# EAGLE design mSD-Breakout_v10 (EAGLE 7.5.0)
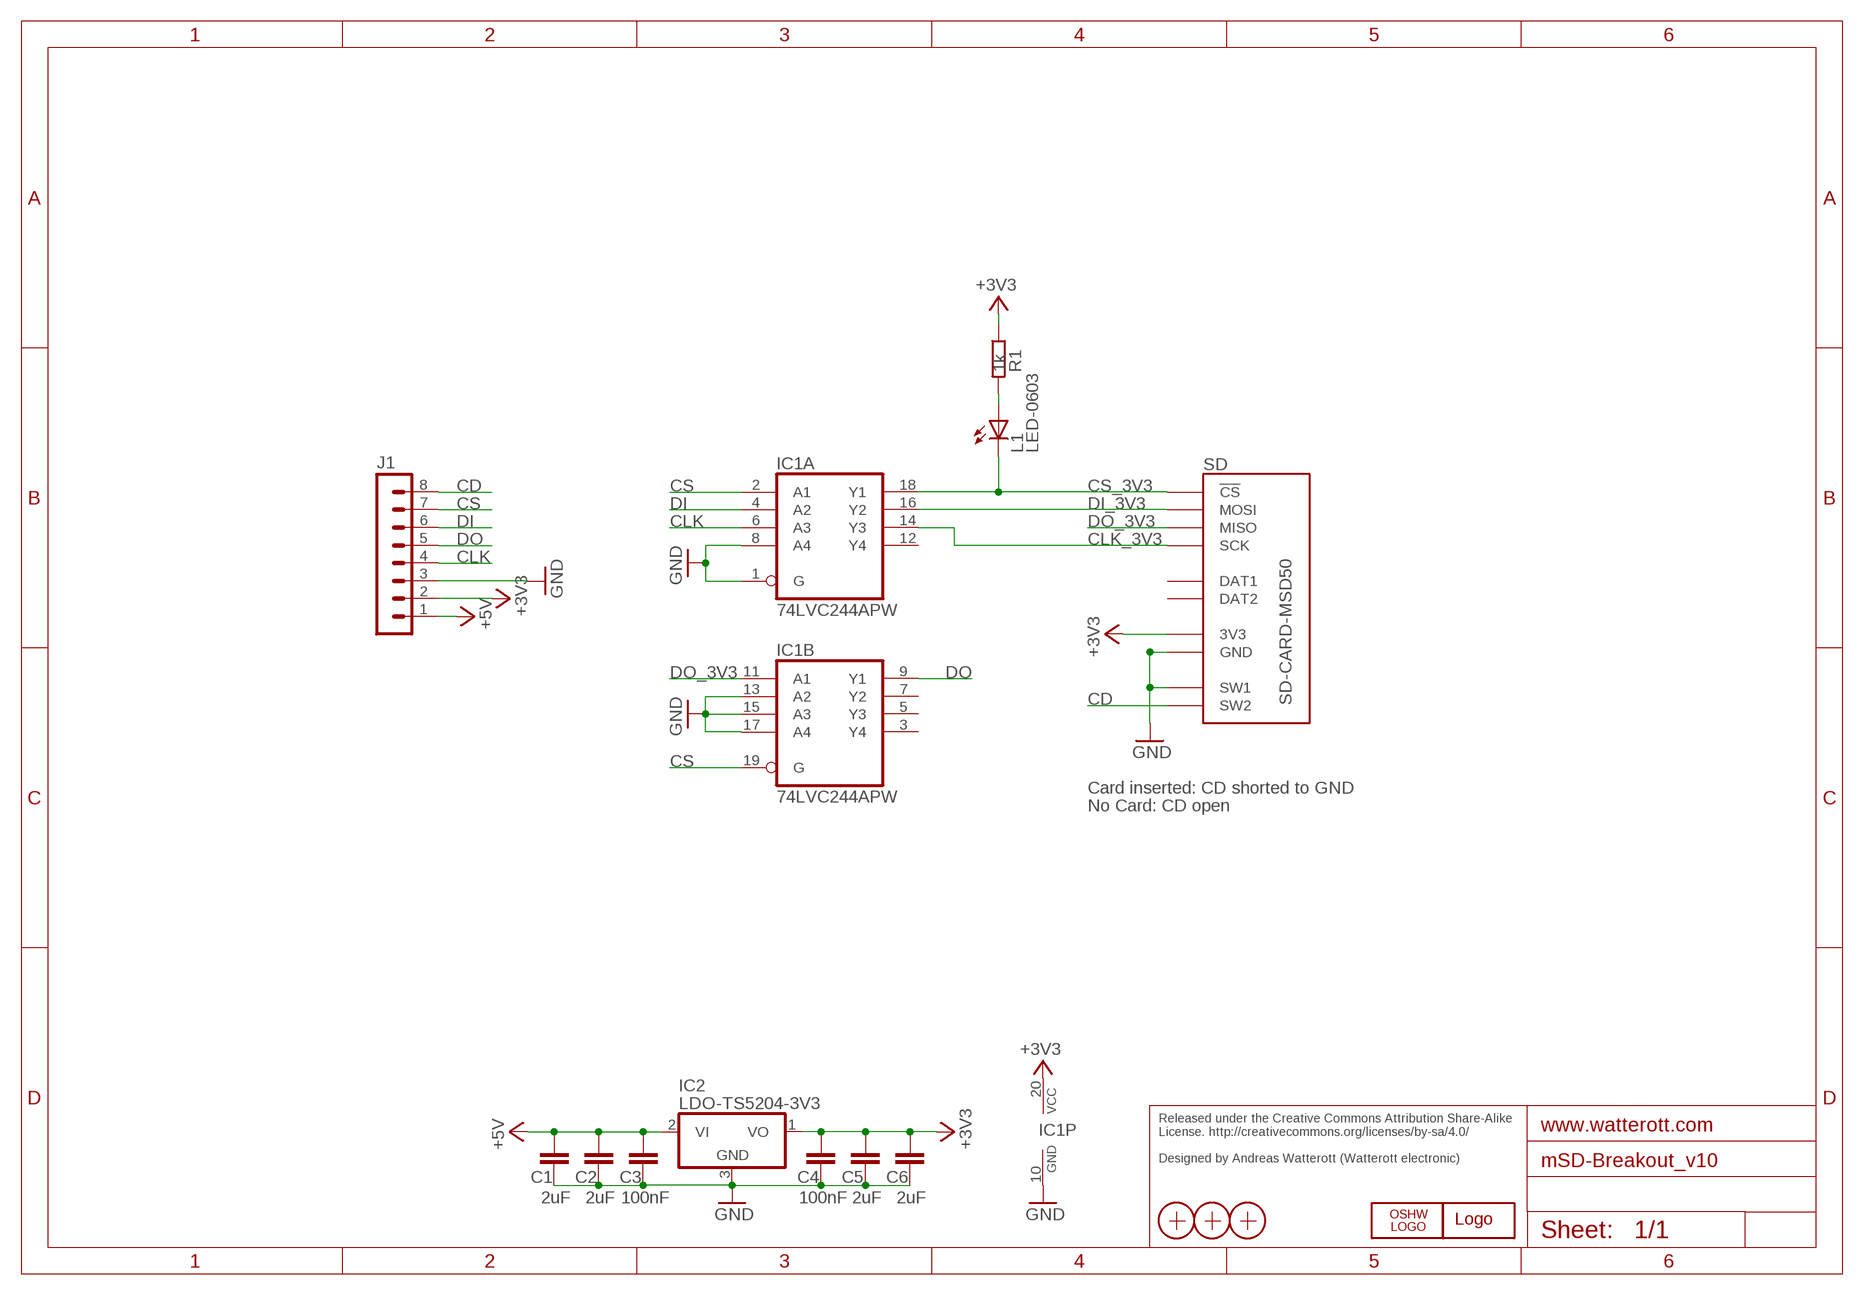
[diagram p0: schematic, sheet 1]

## Parts
C1  2uF  C-EUC0603  [C0603]
C2  2uF  C-EUC0603  [C0603]
C3  100nF  C-EUC0603  [C0603]
C4  100nF  C-EUC0603  [C0603]
C5  2uF  C-EUC0603  [C0603]
C6  2uF  C-EUC0603  [C0603]
IC1  74LVC244APW  74LVC244PW  [TSSOP20]
IC2  LDO-TS5204-3V3  LDO-TS5204  [SOT23]
J1  MA08-1  [MA08-1]
L1  LED-0603  [LED_0603]
LOGO1  OSHW_LOGOX0100  [OSHW_6X100]
LOGO2  LOGO-SPARK_PLACE  [SPARK_TPLACE]
R1  1k  R-EU_R0603  [R0603]
SD  SD-CARD-MSD50  [SD_5031821853]
X1  PASSER  [PASSER]
X2  PASSER  [PASSER]
X3  PASSER  [PASSER]

## Nets
+3V3: C4.1 C5.1 C6.1 IC1.20(P:VCC) IC2.1(VO) J1.2 R1.1 SD.VCC(3V3)
+5V: C1.1 C2.1 C3.1 IC2.2(VI) J1.1
CD: J1.8 SD.SW2
CLK: IC1.6(A:A3) J1.4
CLK_3V3: IC1.14(A:Y3) SD.SCK
CS: IC1.2(A:A1) IC1.19(B:G) J1.7
CS_3V3: IC1.18(A:Y1) L1.C SD.CS(!CS)
DI: IC1.4(A:A2) J1.6
DI_3V3: IC1.16(A:Y2) SD.MOSI
DO: IC1.9(B:Y1) J1.5
DO_3V3: IC1.11(B:A1) SD.MISO
GND: C1.2 C2.2 C3.2 C4.2 C5.2 C6.2 IC1.1(A:G) IC1.8(A:A4) IC1.10(P:GND) IC1.13(B:A2) IC1.15(B:A3) IC1.17(B:A4) IC2.3(GND) J1.3 SD.GND SD.SW1
N$1: L1.A R1.2
Unconnected: IC1.3(B:Y4) IC1.5(B:Y3) IC1.7(B:Y2) IC1.12(A:Y4) SD.DAT1 SD.DAT2

## Notes on the sheet
- Card inserted: CD shorted to GND
- No Card: CD open
- Released under the Creative Commons Attribution Share-Alike 
  License. http://creativecommons.org/licenses/by-sa/4.0/
  
  Designed by Andreas Watterott (Watterott electronic)

## Library data of the parts
C1-C6 = rcl:C-EU: CAPACITOR, European symbol
IC1 = we-chip:74*244: 74x244 Octal Buffer and Line Driver (3-State)
IC2 = we-power:LDO
J1 = we-con:MA08-1: PIN HEADER; OC_FARNELL: unknown; OC_NEWARK: unknown
L1 = we-opto:LED
LOGO1 = we-symbol:OSHW_LOGO
LOGO2 = we-symbol:LOGO
R1 = rcl:R-EU_: RESISTOR, European symbol
SD = we-con:SD-CARD; DIGIKEY: WM9750TR-ND
X1-X3 = we-symbol:PASSER

## Board
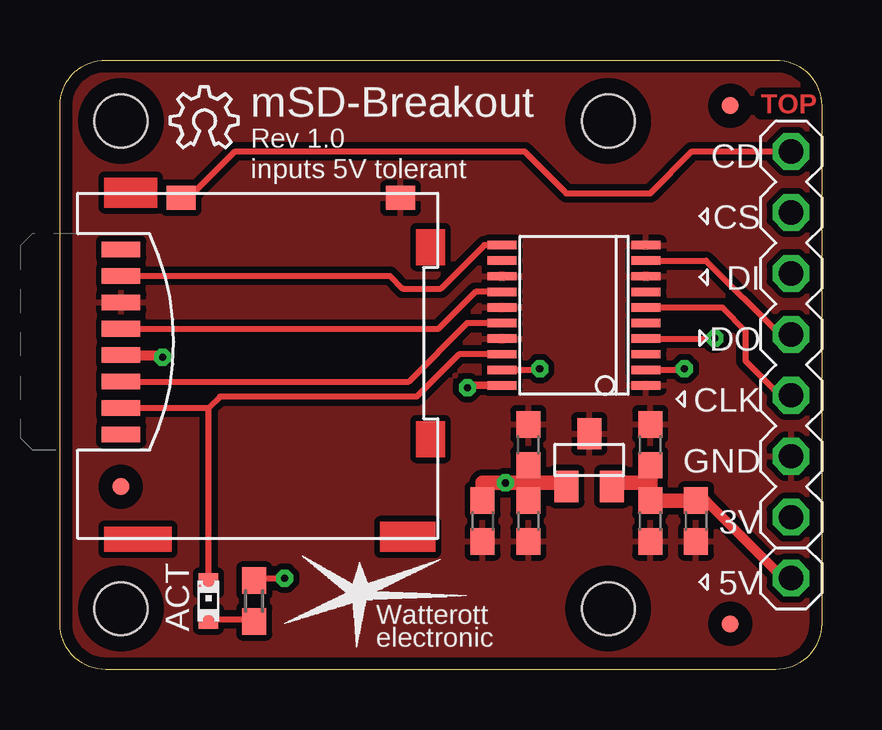
[diagram p1: board, top side]
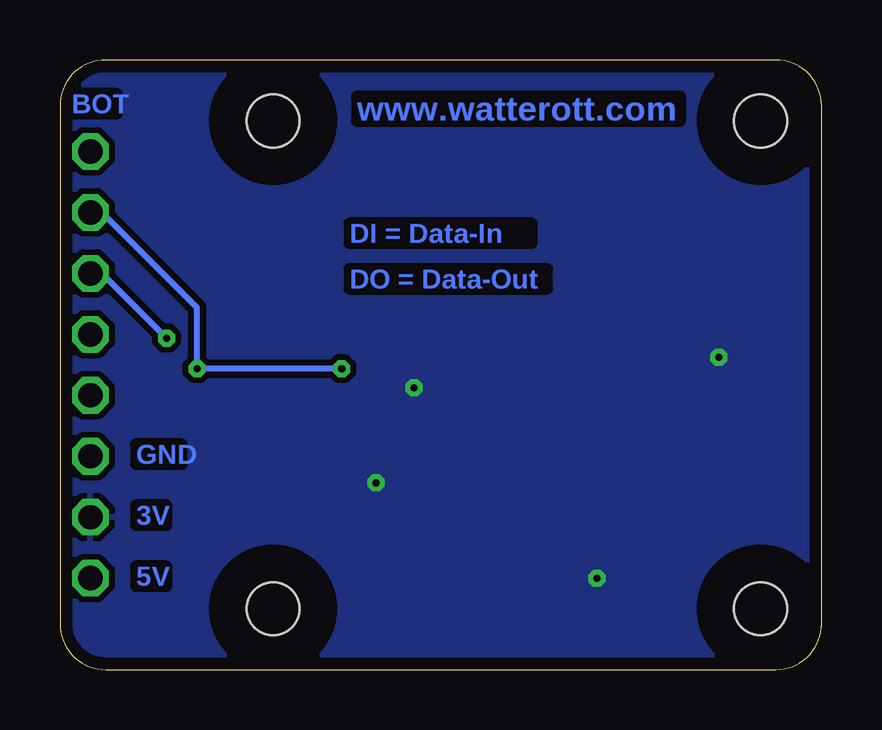
[diagram p2: board, bottom side, seen from below]

Size 31.75 x 25.4 mm. Coordinates in mm from the lower left corner, seen from the top.
Outline: 31.75,1.91 arc-90 29.84,0 1.91,0 arc-90 0,1.91 0,23.5 arc-90 1.91,25.4 29.84,25.4 arc-90 31.75,23.5 31.75,1.91
Copper layers (1*16): Top 0.035mm / dielectric 1.5mm / Bottom 0.035mm
Design rules "default *": minimum track width 8mil, minimum drill 0.3mm, track to track 8mil, track to pad 8mil, pad to pad 8mil, via to via 8mil, smd to smd 8mil, copper to edge 20mil, drill to drill 8mil, minimum pad ring 10mil, minimum via ring 8mil, stop-mask expansion 0.3mm, vias tented up to drill 0.5mm, thermal gap 10mil
Holes 2.2 mm at 2.54,22.86 2.54,2.54 22.86,22.86 22.86,2.54
tRestrict: area 1.1,1.1 to 3.9,3.9; area 21.5,1.1 to 24.3,3.9; area 21.5,21.5 to 24.3,24.3; area 1.1,21.5 to 3.9,24.3
bRestrict: area 0.3,0.3 to 4.8,4.8; area 20.6,0.3 to 25.1,4.8; area 20.6,20.6 to 25.1,25.1; area 0.3,20.6 to 4.8,25.1

### Footprints (pad centres in the part's own frame; a part is rotated, then mirrored left to right if it is on the bottom)
C0603 = smd 1.1 x 1: 1 -0.85,0; 2 0.85,0
TSSOP20 = smd 0.35 x 1.2: 1 -2.925,-3; 2 -2.275,-3; 3 -1.625,-3; 4 -0.975,-3; 5 -0.325,-3; 6 0.325,-3; 7 0.975,-3; 8 1.625,-3; 9 2.275,-3; 10 2.925,-3; 11 2.925,3; 12 2.275,3; 13 1.625,3; 14 0.975,3; 15 0.325,3; 16 -0.325,3; 17 -0.975,3; 18 -1.625,3; 19 -2.275,3; 20 -2.925,3
SOT23 = smd 1 x 1.3: 1 -0.95,-1.1; 2 0.95,-1.1; 3 0,1.1
MA08-1 = drill 1.016 octagon: 1 -8.89,0; 2 -6.35,0; 3 -3.81,0; 4 -1.27,0; 5 1.27,0; 6 3.81,0; 7 6.35,0; 8 8.89,0
LED_0603 = smd 0.8 x 0.8: A 0,-0.75; C 0,0.75
R0603 = smd 1.1 x 1: 1 -0.85,0; 2 0.85,0
SD_5031821853 = smd 0.65 x 1.6: CS 2.75,0.8; DAT1 -3.85,0.8; DAT2 3.85,0.8; GND -1.65,0.8; MISO -2.75,0.8; MOSI 1.65,0.8; SCK -0.55,0.8; VCC 0.55,0.8 | smd 1 x 1.2: SW1 -6,12.45; SW2 -6,3.3
PASSER = smd 0.7 x 0.7: X 0,0

### Placement (x,y rotation side)
C1  26.51,6.19 270 top
C2  24.61,6.19 270 top
C3  24.61,9.37 90 top
C4  19.53,9.37 90 top
C5  19.53,6.19 270 top
C6  17.62,6.19 270 top
IC1  21.43,14.76 90 top
IC2  22.07,8.73 0 top
J1  30.48,12.7 90 top
L1  6.19,2.86 0 top
LOGO1  4.6,21.75 0 top
LOGO2  12.54,3.17 0 top
R1  8.1,2.86 270 top
SD  1.75,13.65 270 top
X1  2.54,7.62 90 top
X2  27.94,23.5 90 top
X3  27.94,1.91 90 top

### Tracks (layer width: path | path; a pad name or v marks a point on that pad's centre or on a via)
+3V3  (via drill 0.3)
  Top 0.254: R1.1 8.1,3.81 v9.37,3.81
  Top 0.305: IC1.20 17.08,11.84 v16.99,11.75
  Top 0.406: SD.VCC 4.2,13.1 v4.29,13.02
  Top 0.61: C5.1 19.53,7.78 | 19.53,7.78 C4.1 | 19.53,7.78 v18.57,7.78 17.62,7.78 C6.1 | 19.53,7.78 20.97,7.78 IC2.1
  pour Bottom (isolate 0.254): 0,25.4 31.75,25.4 31.75,0 0,0
+5V
  Top 0.406: C1.1 26.93,7.04 30.16,3.81 J1.1
  Top 0.61: 24.61,7.78 C2.1 C1.1 | 24.61,7.78 C3.1 | 24.61,7.78 23.26,7.78 23.12,7.63 IC2.2
CD
  Top 0.254: SD.SW2 5.05,19.49 5.21,19.49 7.3,21.59 19.37,21.59 21.11,19.84 24.61,19.84 26.35,21.59 J1.8
CLK
  Top 0.254: J1.4 30,11.43 28.57,12.86 28.57,14.13 27.61,15.09 IC1.6
CLK_3V3
  Top 0.254: SD.SCK 15.79,14.2 17.33,15.74 IC1.14
CS  (via drill 0.3)
  Top 0.254: IC1.2 25.98,12.49 v26.04,12.54 | IC1.19 19.95,12.49 v20,12.54
  Bottom 0.254: J1.7 30,19.05 26.04,15.08 v26.04,12.54 v20,12.54
CS_3V3
  Top 0.254: SD.CS 6.19,10.9 | L1.C 6.19,10.9 | IC1.18 16.63,13.14 14.87,11.38 6.67,11.38 6.19,10.9
DI  (via drill 0.3)
  Top 0.254: IC1.4 27.28,13.79 v27.3,13.81
  Bottom 0.254: J1.6 30,16.51 v27.3,13.81
DI_3V3
  Top 0.254: SD.MOSI 14.54,12 16.98,14.44 IC1.16
DO
  Top 0.254: IC1.9 26.93,17.04 30,13.97 J1.5
DO_3V3
  Top 0.254: SD.MISO 13.76,16.4 14.29,15.88 15.88,15.88 17.69,17.69 IC1.11
GND
  pour Top (isolate 0.254): 0,25.4 31.75,25.4 31.75,0 0,0
N$1
  Top 0.254: L1.A 8,2.11 R1.2

### Text on the board
Top: TOP
Bottom: www.watterott.com | BOT | DI = Data-In | DO = Data-Out | GND | 3V | 5V
tPlace: mSD-Breakout | Rev 1.0 | CD | inputs 5V tolerant | CS | DI | DO | CLK | GND | 3V | 5V | ACT | Watterott | electronic
Reference: Silkscreen: 21 tPlace